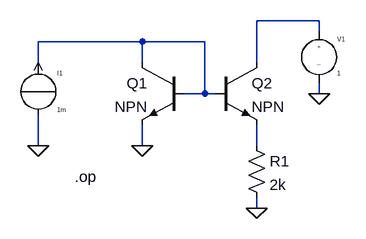
[diagram p0: schematic widlar_stromquelle.asc]
widlar_stromquelle.asc, the LTspice schematic file:
Version 4
SHEET 1 880 680
WIRE 368 16 272 16
WIRE 368 32 368 16
WIRE 96 48 -64 48
WIRE 192 48 96 48
WIRE -64 80 -64 48
WIRE 96 80 96 48
WIRE 272 80 272 16
WIRE 192 128 192 48
WIRE 192 128 160 128
WIRE 208 128 192 128
WIRE 368 128 368 112
WIRE -64 208 -64 160
WIRE 96 208 96 176
WIRE 272 208 272 176
WIRE 272 304 272 288
FLAG -64 208 0
FLAG 96 208 0
FLAG 368 128 0
FLAG 272 304 0
SYMBOL EIT_Semiconductors\\npn 208 80 R0
SYMATTR InstName Q2
SYMBOL EIT_Semiconductors\\npn 160 80 M0
SYMATTR InstName Q1
SYMBOL source-I -64 80 R0
SYMATTR InstName I1
SYMATTR Value 1m
SYMBOL source-V 368 16 R0
WINDOW 123 0 0 Left 2
WINDOW 39 0 0 Left 2
SYMATTR InstName V1
SYMATTR Value 1
SYMBOL res 256 192 R0
SYMATTR InstName R1
SYMATTR Value 2k
TEXT -8 256 Left 2 !.op

The netlist it stands for:
* widlar_stromquelle.asc
Q2 N001 N002 N003 0 NPN
Q1 N002 N002 0 0 NPN
I1 0 N002 1m
V1 N001 0 1
R1 N003 0 2k
.model NPN NPN
.model PNP PNP
.lib standard.bjt
.op
.backanno
.end